# Altium project motherboard_2ch_arduino.PrjPcb
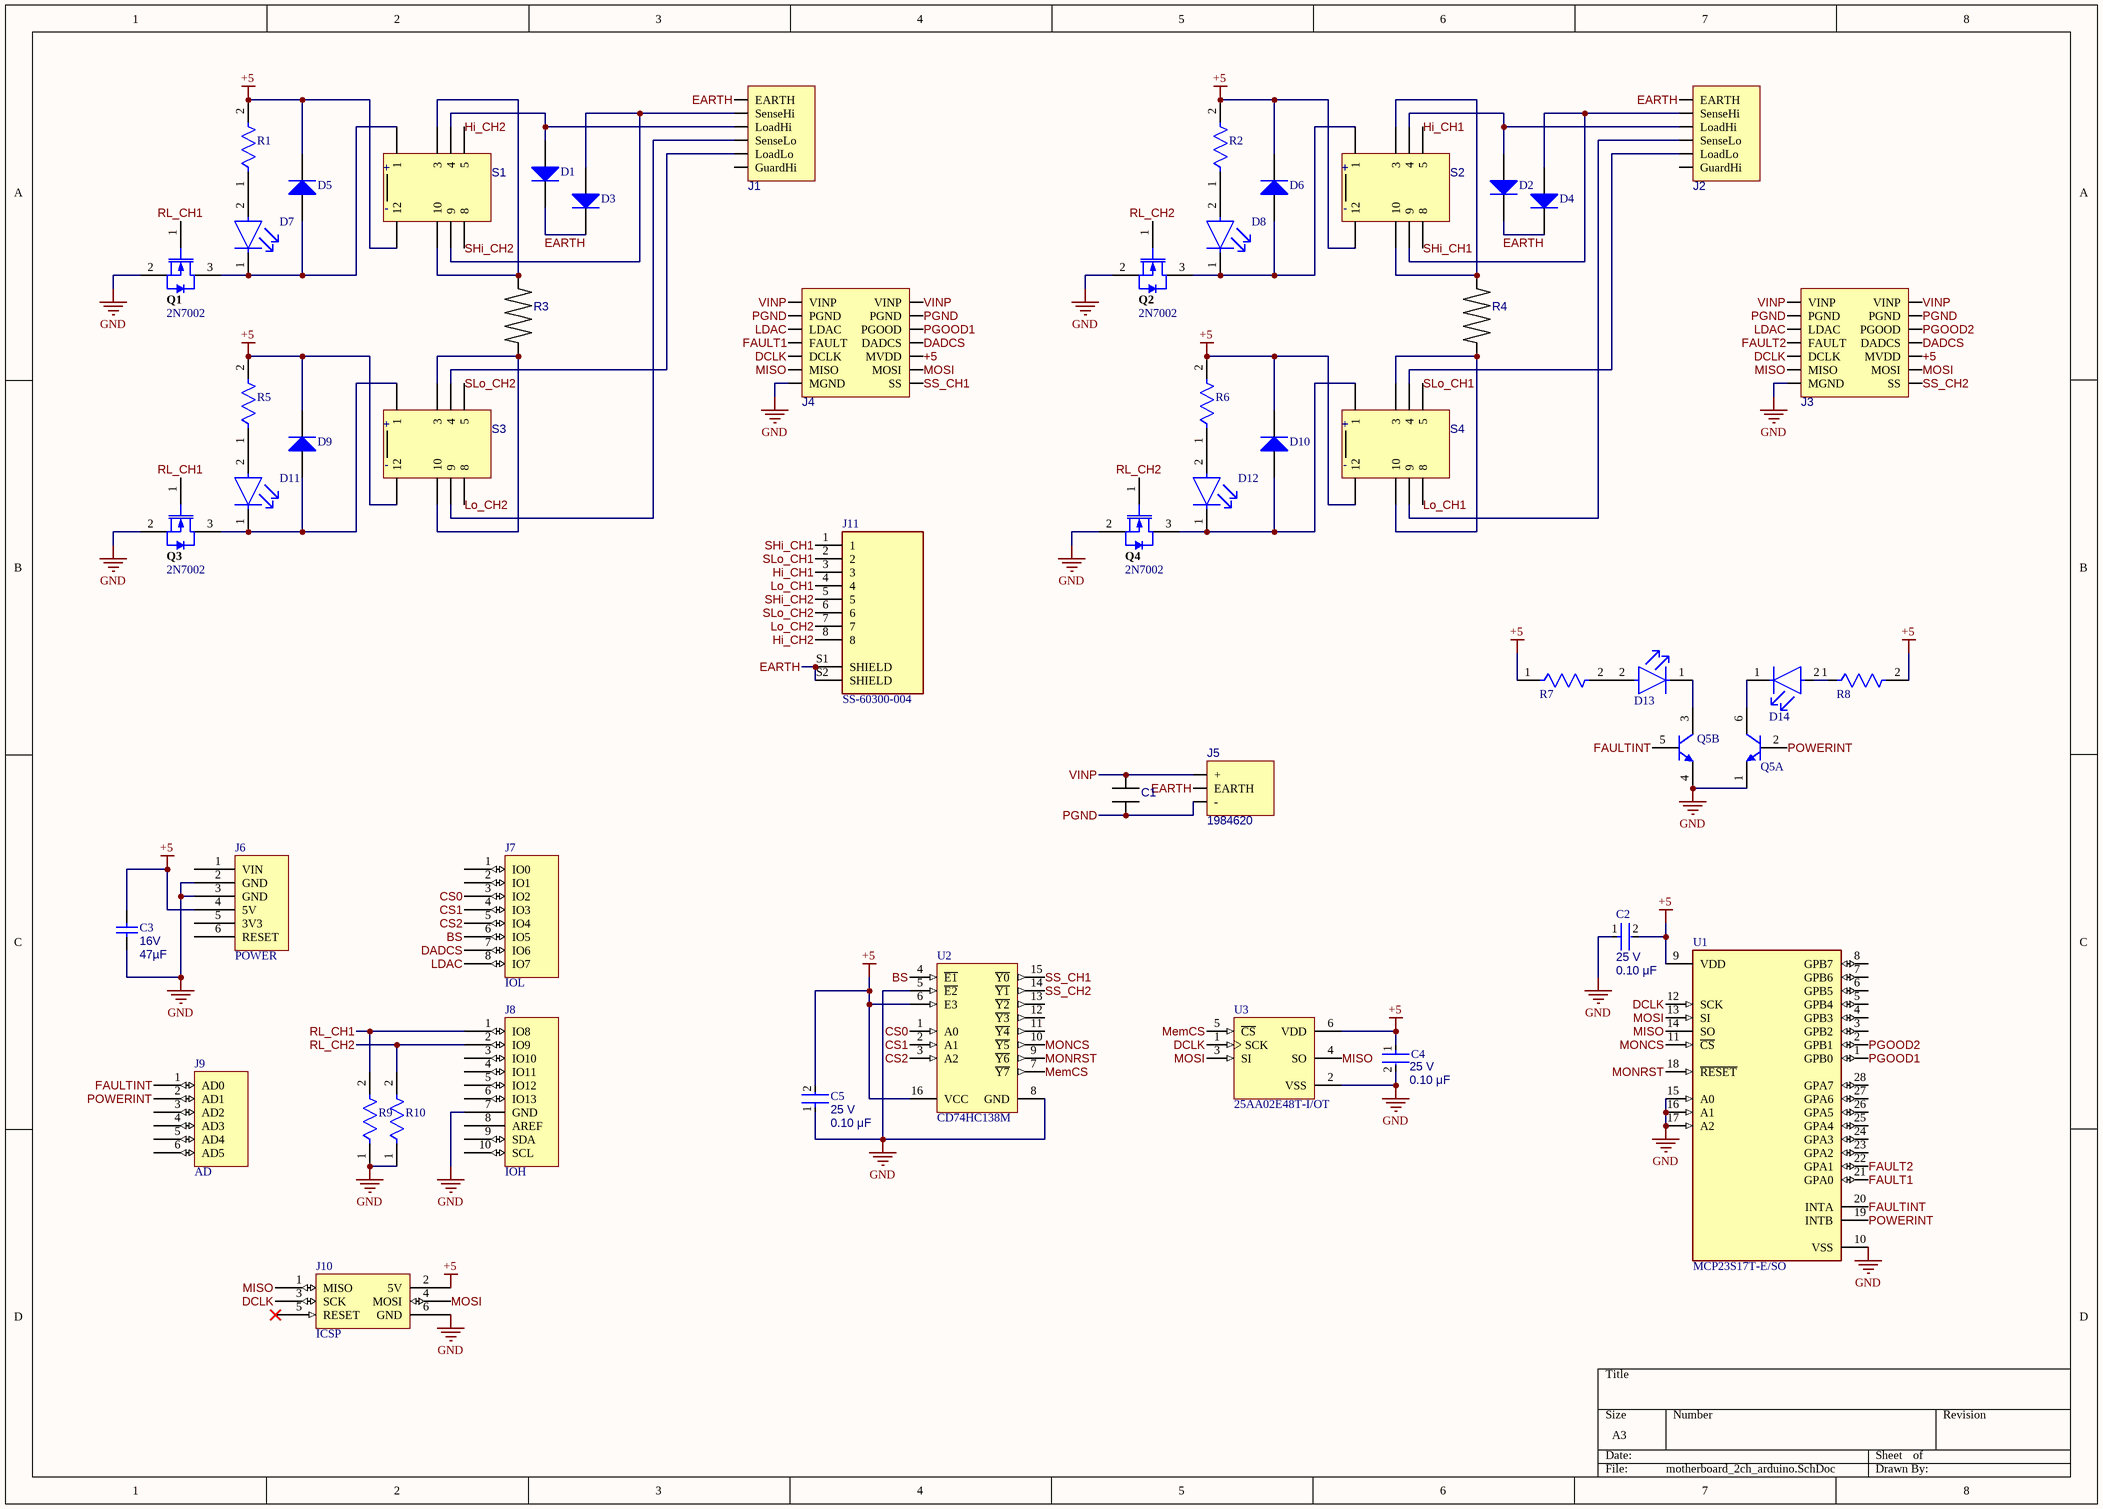
[diagram p0: motherboard_2ch_arduino.SchDoc]
1 sheet, 52 parts. Net scope: global (net labels, ports and power ports of the same name join across sheets).
Board file: motherboard_2ch_arduino.PcbDoc

## Sheet motherboard_2ch_arduino.SchDoc
size A3

### Parts
C1  KRM55TR71H226MH01L  [CAPC6050X50M]  (value not drawn)
C2  value 0.10 μF  Voltage Rating: 25 V  [FP-C1206C-EB-IPC_A]  (hidden comment: C1206C104J3GACAUTO)
C3  Voltage Rating DC: 16V  Capacitance: 47µF  [MURA-1210_H_2.7_M]  (hidden comment: 1210YD107MAT2A)
C4  value 0.10 μF  Voltage Rating: 25 V  [FP-C1206C-EB-IPC_A]  (hidden comment: C1206C104J3GACAUTO)
C5  value 0.10 μF  Voltage Rating: 25 V  [FP-C1206C-EB-IPC_A]  (hidden comment: C1206C104J3GACAUTO)
D1  SMAJ33CA-TR  [STM-SMA-2_V]  (value not drawn)
D2  SMAJ33CA-TR  [STM-SMA-2_V]  (value not drawn)
D3  SMAJ33CA-TR  [STM-SMA-2_V]  (value not drawn)
D4  SMAJ33CA-TR  [STM-SMA-2_V]  (value not drawn)
D5  1N4148W-7-F  [DIOD-SOD123-2_V]  (value not drawn)
D6  1N4148W-7-F  [DIOD-SOD123-2_V]  (value not drawn)
D7  LTST-C150KGKT  [FP-LTST-C150KGKT-MFG]  (value not drawn)
D8  LTST-C150KGKT  [FP-LTST-C150KGKT-MFG]  (value not drawn)
D9  1N4148W-7-F  [DIOD-SOD123-2_V]  (value not drawn)
D10  1N4148W-7-F  [DIOD-SOD123-2_V]  (value not drawn)
D11  LTST-C150KGKT  [FP-LTST-C150KGKT-MFG]  (value not drawn)
D12  LTST-C150KGKT  [FP-LTST-C150KGKT-MFG]  (value not drawn)
D13  LTST-C150KGKT  [FP-LTST-C150KGKT-MFG]  (value not drawn)
D14  LTST-C150KGKT  [FP-LTST-C150KGKT-MFG]  (value not drawn)
J1  5-146276-6  [SMUIO]  (value not drawn)
J2  5-146276-6  [SMUIO]  (value not drawn)
J3  5-146252-7  [DATAIO]  (value not drawn)
J4  5-146252-7  [DATAIO]  (value not drawn)
J5  1984620  [1984620]
J6  POWER  [Header 6x1 8.5mm]
J7  IOL  [Header 8x1 8.5mm]
J8  IOH  [Header 10x1 8.5mm]
J9  AD  [Header 6x1 8.5mm]
J10  ICSP  [ICSP]
J11  SS-60300-004  [BEL_SS-60300-004]
Q1  2N7002  [INF-PG-SOT23_M]
Q2  2N7002  [INF-PG-SOT23_M]
Q3  2N7002  [INF-PG-SOT23_M]
Q4  2N7002  [INF-PG-SOT23_M]
Q5  MBT3904DW1T1G  [ONSC-SOT-363-6-419B-02_W_V]  (value not drawn)  (parts A,B of 2)
R1  RN73R2BTTD1001B25  [FP-RC3216-IPC_A]  (value not drawn)
R2  RC3216J102CS  [FP-RC3216-IPC_A]  (value not drawn)
R3  Y1453500R000V9L  [Y1453500R000V9L]  (value not drawn)
R4  Y1453500R000V9L  [Y1453500R000V9L]  (value not drawn)
R5  RC3216J102CS  [FP-RC3216-IPC_A]  (value not drawn)
R6  RC3216J102CS  [FP-RC3216-IPC_A]  (value not drawn)
R7  RC3216J102CS  [FP-RC3216-IPC_A]  (value not drawn)
R8  RC3216J102CS  [FP-RC3216-IPC_A]  (value not drawn)
R9  RN73H2BTTD1002B10  [FP-RC3216-IPC_A]  (value not drawn)
R10  RN73H2BTTD1002B10  [FP-RC3216-IPC_A]  (value not drawn)
S1  G6S-2 DC5  [EE2-5NU]  (value not drawn)
S2  G6S-2 DC5  [EE2-5NU]  (value not drawn)
S3  G6S-2 DC5  [EE2-5NU]  (value not drawn)
S4  G6S-2 DC5  [EE2-5NU]  (value not drawn)
U1  MCP23S17T-E/SO  [FP-C04-052-MFG]
U2  CD74HC138M  [D0016A_M]
U3  25AA02E48T-I/OT  [SOT-23-OT6_M]

### Nets
+5: C2.2 C3.2 C4.1 C5.2 D5.2(K) D6.2(K) D9.2(K) D10.2(K) J3.10(MVDD) J4.10(MVDD) J6.4(5V) J10.2(5V) R1.2 R2.2 R5.2 R6.2 R7.1 R8.2 S1.12 S2.12 S3.12 S4.12 U1.9(VDD) U2.6(E3) U2.16(VCC) U3.6(VDD)
GND: C2.1 C3.1 C4.2 C5.1 J3.13(MGND) J4.13(MGND) J6.2(GND) J6.3(GND) J8.7(GND) J10.6(GND) Q1.2(SOURCE) Q2.2(SOURCE) Q3.2(SOURCE) Q4.2(SOURCE) Q5.1(E) Q5.4(E) R9.1 R10.1 U1.10(VSS) U1.15(A0) U1.16(A1) U1.17(A2) U2.5(~{E2}) U2.8(GND) U3.2(VSS)
BS: J7.6(IO5) U2.4(~{E1})
CS0: J7.3(IO2) U2.1(A0)
CS1: J7.4(IO3) U2.2(A1)
CS2: J7.5(IO4) U2.3(A2)
DADCS: J3.8(DADCS) J4.8(DADCS) J7.7(IO6)
DCLK: J3.9(DCLK) J4.9(DCLK) J10.3(SCK) U1.12(SCK) U3.1(SCK)
EARTH: D1.2(K) D2.2(K) D3.2(K) D4.2(K) J1.1(EARTH) J2.1(EARTH) J5.2(EARTH) J11.S1(SHIELD) J11.S2(SHIELD)
FAULT1: J4.7(FAULT) U1.21(GPA0)
FAULT2: J3.7(FAULT) U1.22(GPA1)
FAULTINT: J9.1(AD0) Q5.5(B) U1.20(INTA)
Hi_CH1: J11.3 S2.5
Hi_CH2: J11.8 S1.5
LDAC: J3.5(LDAC) J4.5(LDAC) J7.8(IO7)
Lo_CH1: J11.4 S4.8
Lo_CH2: J11.7 S3.8
MemCS: U2.7(~{Y7}) U3.5(~{CS})
MISO: J3.11(MISO) J4.11(MISO) J10.1(MISO) U1.14(SO) U3.4(SO)
MONCS: U1.11(~{CS}) U2.10(~{Y5})
MONRST: U1.18(~{RESET}) U2.9(~{Y6})
MOSI: J3.12(MOSI) J4.12(MOSI) J10.4(MOSI) U1.13(SI) U3.3(SI)
PGND: C1.1 J3.3(PGND) J3.4(PGND) J4.3(PGND) J4.4(PGND) J5.3(-)
PGOOD1: J4.6(PGOOD) U1.1(GPB0)
PGOOD2: J3.6(PGOOD) U1.2(GPB1)
POWERINT: J9.2(AD1) Q5.2(B) U1.19(INTB)
RL_CH1: J8.1(IO8) Q1.1(GATE) Q3.1(GATE) R9.2
RL_CH2: J8.2(IO9) Q2.1(GATE) Q4.1(GATE) R10.2
SHi_CH1: J11.1 S2.8
SHi_CH2: J11.5 S1.8
SLo_CH1: J11.2 S4.5
SLo_CH2: J11.6 S3.5
SS_CH1: J4.14(SS) U2.15(~{Y0})
SS_CH2: J3.14(SS) U2.14(~{Y1})
VINP: C1.2 J3.1(VINP) J3.2(VINP) J4.1(VINP) J4.2(VINP) J5.1(+)
NetD1_1: D1.1(A) J1.3(LoadHi) S1.4
NetD2_1: D2.1(A) J2.3(LoadHi) S2.4
NetD3_1: D3.1(A) J1.2(SenseHi) S1.9
NetD4_1: D4.1(A) J2.2(SenseHi) S2.9
NetD5_1: D5.1(A) D7.1(C) Q1.3(DRAIN) S1.1
NetD6_1: D6.1(A) D8.1(C) Q2.3(DRAIN) S2.1
NetD7_2: D7.2(A) R1.1
NetD8_2: D8.2(A) R2.1
NetD9_1: D9.1(A) D11.1(C) Q3.3(DRAIN) S3.1
NetD10_1: D10.1(A) D12.1(C) Q4.3(DRAIN) S4.1
NetD11_2: D11.2(A) R5.1
NetD12_2: D12.2(A) R6.1
NetD13_1: D13.1(C) Q5.3(C)
NetD13_2: D13.2(A) R7.2
NetD14_1: D14.1(C) Q5.6(C)
NetD14_2: D14.2(A) R8.1
NetJ1_4: J1.4(SenseLo) S3.9
NetJ1_5: J1.5(LoadLo) S3.4
NetJ2_4: J2.4(SenseLo) S4.9
NetJ2_5: J2.5(LoadLo) S4.4
NetR3_1: R3.1 S3.3 S3.10
NetR3_2: R3.2 S1.3 S1.10
NetR4_1: R4.1 S4.3 S4.10
NetR4_2: R4.2 S2.3 S2.10

Not connected (* = marked no-connect by the designer): J1 6(GuardHi); J2 6(GuardHi); J6 1(VIN) 5(3V3) 6(RESET); J7 1(IO0) 2(IO1); J8 3(IO10) 4(IO11) 5(IO12) 6(IO13) 8(AREF) 9(SDA) 10(SCL); J9 3(AD2) 4(AD3) 5(AD4) 6(AD5); J10 5(RESET)*; U1 3(GPB2) 4(GPB3) 5(GPB4) 6(GPB5) 7(GPB6) 8(GPB7) 23(GPA2) 24(GPA3) 25(GPA4) 26(GPA5) 27(GPA6) 28(GPA7); U2 11(~{Y4}) 12(~{Y3}) 13(~{Y2})

### Notes on the sheet
- (in symbol EE2-5NU) +; -

### Library data of the parts
C1 = CAP22uF
C2 C4 C5 = CMP-03020-020888-1: CAP CER 0.1UF 25V C0G/NP0 1206; Manufacturer: KEMET; Temperature Characteristic: C0G; Material: Ceramic; Automotive Grade: Grade 0; Tolerance: 0.05; Temperature Coefficient: 15%; Digikey Description: CAP CER 0.1UF 25V C0G/NP0 1206; Category: Cap; Automotive: Yes; Manufacturer Part Number: C1206C104J3GACAUTO; Device Class L1: Passive Components; Ipc Land Pattern Name: CAPC320160X78; ComponentLink2Description: Datasheet; Temperature Range High: +150°C; Capacitance: 0.10 μF; Mouser Description: Multilayer Ceramic Capacitor, AEC-Q200 MLCC Series, 0.1 - F, - 5%, C0G / NP0, 25 V; Lead Free: Yes; Temperature: -55°C to +150°C; Device Class L2: Capacitors; Octopart: https://octopart.com/c1206c104j3gacauto-kemet-22570084; RoHS: TRUE; Temperature Range Low: -55°C; ComponentLink2URL: https://content.kemet.com/datasheets/KEM_C1007_X8R_ULTRA_150C_SMD.pdf; Device Class L3: Ceramic Capacitors; Height: 0.88mm; Package: C1206C-EB
C3 = CMP-2000-06362-1: Cap Ceramic, 47 uF, +/- 10%, -55 to 85 degC, 2-Pin SMD (1210), RoHS, Tape and Reel; Manufacturer: Murata; Catalog Drawings: GRMSeries_1210_2.5; Product Training Modules: High-CapMultilayerCeramicCapacitors; Temperature Coefficient: X5R; Online Catalog: GRMSeries; Other Names: 490-6539-6; Lead Style: -; Datasheet URL: http://psearch.en.murata.com/capacitor/product/GRM32ER61C476KE15%23.pdf; Package Description: 2-Pin Surface Mount Device, Body 3.2 x 2.5 mm; Applications: GeneralPurpose; Thickness (Max): 0.106"(2.70mm); Operating Temperature: -55°C~85°C; Mounting Technology: SurfaceMount; Category: Capacitors; Package / Case: 1210(3225Metric); Mounting Type: SurfaceMount,MLCC; Ratings: -; Package Reference: 1210; Height - Seated (Max): -; Series: GRM; Lead Spacing: -; Family: CeramicCapacitors; Datasheet Version: 04/2016; Tolerance: ±10%; Size / Dimension: 0.126"Lx0.098"W(3.20mmx2.50mm); Packaging: Digi-Reel®; Voltage - Rated: 16V; Standard Package: 1; Features: -; Manufacturer URL: http://www.murata.com/
D1-D4 = CMP-2000-05373-2: Transil(TM) Diode, 33 A, 36.7 V, -55 to 150 degC, 2-Pin SMA, RoHS, Tape and Reel; Manufacturer: STMicroelectronics; TVS Polarity: Bidirectional; Peak Pulse Power Dissipation: 400W; Power Dissipation Pd: 400 / W; Reverse Stand-Off Voltage Vrwm: 33V; Breakdown Voltage Min: 36.7V; Product Range: SMAJSeries; Peak Pulse Current Ippm: 7.5 / A; Clamping Voltage Vc Max: 69.7V; No. of Pins: 2Pins; Diode Case Style: DO-214AC; SVHC: NoSVHC(17-Dec-2015); Manufacturer URL: http://www.st.com/; Package Description: 2-Pin Surface Mount Device, Body 4.275 x 2.575 mm; Datasheet Version: Rev. 12, 07/2010; Datasheet URL: http://www.st.com/st-web-ui/static/active/en/resource/technical/document/datasheet/CD00001333.pdf; Packaging: CutTape; Package Reference: SMA; Package URL: http://www.st.com/st-web-ui/static/active/en/resource/technical/document/datasheet/CD00283518.pdf
D5 D6 D9 D10 = CMP-2000-04932-2: Fast Switching Diode, 100 V, 0.15 A, -65 to 150 degC, 2-Pin?SOD123, RoHS, Tape and Reel; Recovery Time: 4ns; Brand: DiodesIncorporated; Unit Weight: 0.000353oz; Max Surge Current: 2A; Peak Reverse Voltage: 100V; Ir - Reverse Current: 1uA; Vf - Forward Voltage: 1.25V; Configuration: Single; If - Forward Current: 0.15A; Product Category: Diodes-GeneralPurpose,Power,Switching; Operating Temperature Range: -65Cto+150C; Packaging: Reel; Manufacturer URL: http://www.diodes.com/; Maximum Operating Temperature: +150C; Height: 1.25mm; Minimum Operating Temperature: -65C; Product: SwitchingDiodes; Package URL: http://www.diodes.com/datasheets/ds18004.pdf; Type: SwitchingDiode; Package Reference: SOD123-2; Width: 1.7mm; Datasheet URL: http://www.farnell.com/datasheets/1915529.pdf; Datasheet Version: Rev. 24-2, 10/2013; Series: 1N4148; Factory Pack Quantity: 3000; Length: 2.85mm; RoHS: True; Manufacturer: DiodesIncorporated; Mounting Style: SMD/SMT; Package / Case: SOD-123
D7 D8 D11-D14 = CMP-22017-000010-1: LED GREEN CLEAR 1206 SMD; Power Dissipation: 75mW; Number of LEDs: 1; Reverse Voltage: 5V; Lens Style: Diffused; Test Current: 20mA; Forward Current: 30mA; Luminous Intensity: 71mcd; Dominant Wavelength: 571nm; Lens Color: Colorless; Viewing Angle: 130°; Forward Voltage: 2V; Wavelength: 574nm; Length: 3.2mm; Case Code (Imperial): 1206; Illumination Color: Green; Number of Pins: 2; Case Code (Metric): 3216; Package Quantity: 1; Height: 1.1mm; Power Rating: 75mW; Color: Green; Lead Free: Lead Free; Mount: Surface Mount; Radiation Hardening: No; Max Operating Temperature: 85°C; Depth: 1.6mm; Case/Package: 1206; Number of Elements: 1; Lens Transparency: Clear; Min Operating Temperature: -55°C; Packaging: Tape and Reel; Width: 1.6mm
J1 J2 = SMUIO
J3 J4 = DATAIO
J5 = POWERJACK
J11 = SS-60300-004: Modular Jack | CAT6a | Horizontal (90) | 8P 8C | NF Shielded; MF: Stewart Connector; MP: SS-60300-004; Package: QFN-16 Stewart Connector; Mouser-Purchase-URL: https://snapeda.com/shop?store=Mouser&id=621521; SnapEDA_Link: https://www.snapeda.com/parts/SS-60300-004/Stewart%20Connector/view-part/621521/?ref=snap; Availability: Unavailable; Price: None; Value: *; DigiKey-Purchase-URL: https://snapeda.com/shop?store=DigiKey&id=621521
Q1-Q4 = CMP-1149-00026-1: N-Channel OptiMOS Small-Signal-Transistor, 60 V VDS, 0.3 A ID, -55 to 150 degC, PG-SOT23, Reel, Green; Manufacturer: Infineon; RDS (on) (max) (@4.5V): 4,000 mOhm; VDS (max): 60 V; IDpuls (max): 1.2Â A; QG: 0.4Â nC; RDS (on) (max): 3,000 mOhm; RthJA (max): 250 K/W; ID (max): 0.3Â A; VGS(th) (max): 2.5Â V; VGS(th) (min): 1.5Â V; Green: TRUE; Ptot (max): 0.5Â W; PackageDescription: 3-Pin Small Outline Transistor Package, 2.9 x 1.3 mm Body, 0.95 mm Pitch; Halogen-free: TRUE; ComponentLink2Description: Datasheet; ComponentLink1URL: http://www.infineon.com/; Packing: Reel; DatasheetVersion: Rev. 2.4; PartNumber: 2N7002; PackageReference: PG-SOT23; PackageVersion: Apr-08; ComponentLink3URL: http://www.infineon.com/dgdl/SOT23-Package_Overview.pdf?folderId=db3a30431936bc4b0119532290053c66&fileId=db3a30431936bc4b0119533468123c85; ComponentLink1Description: Manufacturer URL; Mounting Technology: Surface Mount; ComponentLink3Description: Package Specification; ComponentLink2URL: http://www.infineon.com/dgdl/2N7002_Rev2.4.pdf?folderId=db3a3043156fd573011622e10b5c1f67&fileId=db3a304319bc939a0119c2a9461e79e6
Q5 = CMP-1048-00877-1: Dual General Purpose Transistors, 6-Pin SOT-363, Pb-Free, Tape and Reel; Manufacturer: On Semiconductor; Polarity: Dual NPN; fT Min (MHz): 300; IC Continuous (A): 0.2; DatasheetVersion: Rev. 9; ComponentLink2Description: Datasheet; Mounting Technology: Surface Mount; PackageReference: SOT-363-6-419B-02_W; RoHS: TRUE; ComponentLink1Description: Manufacturer URL; ComponentLink2URL: http://www.onsemi.com/pub_link/Collateral/MBT3904DW1T1-D.PDF; PackageVersion: Rev. W, 01/2006; Packing: Tape and Reel; PartNumber: MBT3904DW1T1G; ComponentLink1URL: http://www.onsemi.com/; ComponentLink3URL: http://www.onsemi.com/pub_link/Collateral/NTJD4001N-D.PDF; ComponentLink3Description: Package Specification; PackageDescription: 6-Pin Small Outline Transistor, Body 2 x 1.25 mm, Pitch 0.65 mm
R1 R2 R5-R8 = CMP-13261-001932-1: Res Thick Film 1206 1kΩ 5% 0.25W ±100ppm/°C Molded SMD T/R; Max Power Dissipation: 250mW; Resistance: 1kR; Voltage Rating (DC): 200V; Width: 0.063inch; Length: 0.126inch; Min Operating Temperature: -55°C; Packaging: Tape and Reel; Case Code (Metric): 3216; Contact Plating: Tin; Composition: Thick Film; Military Standard: Not; Depth: 1.6mm; Lead Free: Lead Free; Height: 0.026inch; Case Code (Imperial): 1206; Number of Terminations: 2; Radiation Hardening: No; Case/Package: 1206; Features: Moisture Resistant; Power Rating: 250mW; Max Operating Temperature: 155°C; Tolerance: 5%; Temperature Coefficient: 100ppm/°C
R9 R10 = CMP-13261-000768-1: RES SMD 10K OHM 1% 1/4W 1206; Resistance: 10kR; Temperature Coefficient: 100ppm/°C; Max Power Dissipation: 250mW; Voltage Rating (DC): 200V; Length: 0.126inch; Tolerance: 1%; Case Code (Imperial): 1206; Radiation Hardening: No; Number of Terminations: 2; Width: 0.063inch; Max Operating Temperature: 155°C; Case Code (Metric): 3216; Case/Package: 1206; Lead Free: Lead Free; Min Operating Temperature: -55°C; Features: Moisture Resistant; Depth: 1.6mm; Composition: Thick Film; Packaging: Tape and Reel; Contact Plating: Tin; Military Standard: Not; Height: 0.026inch
S1-S4 = EE2-5NU
U1 = CMP-06293-000003-1: IC I/O EXPANDER SPI 16B 28SOIC; Power Dissipation: 700mW; Nominal Supply Current: 1mA; Frequency: 10MHz; Min Supply Voltage: 4.5V; Number of Bits: 16; Max Supply Voltage: 5.5V; Number of Channels: 1; Package Quantity: 1600; Min Operating Temperature: -40°C; Mount: Surface Mount; Lead Free: Lead Free; REACH SVHC: No SVHC; Packaging: Tape and Reel; Interface: SPI; Max Operating Temperature: 125°C; Case/Package: SOIC; Number of Pins: 28; Number of I/Os: 16; Max Frequency: 10MHz
U2 = CMP-1633-00149-2: High Speed CMOS Logic 3-to-8 Line Decoder Demultiplexer Inverting and Non-Inverting, D0016A, TUBE; Manufacturer: Texas Instruments; ICC @ Nom Voltage(Max)(mA): 0.08; Schmitt Trigger: No; Configuration: 3：8; tpd @ Nom Voltage(Max)(ns): 30; Input Type: LVTTL/CMOS; Function: Decoder/Demultiplexer; Channels(#): 1; Voltage(Nom)(V): 3.3,5; VCC(Min)(V): 2; VCC(Max)(V): 6; Rating: Catalog; F @ Nom Voltage(Max)(Mhz): 28; Output Drive (IOL/IOH)(Max)(mA): 5.2/-5.2; Technology Family: HC; Bits(#): 8; Operating Temperature Range(C): -55 to 125; PackageReference: D0016A; Type: Standard; Code_JEDEC: MS-012 variation AC; DatasheetVersion: SCHS147I; Generic Part Number: CD74HC138; Output Type: CMOS
U3 = CMP-0165-00270-1: 2K SPI Bus Serial EEPROM with EUI-48 Node Identity, 6-Pin SOT-23, Industrial Temperature, Tape and Reel; DatasheetVersion: revA, Dec-2008; PackageReference: SOT-23-OT6; PackageVersion: revBB, Aug-2009; PackageDescription: 6-Lead Plastic Small Outline Transistor (OT) [SOT-23]; Code_IPC: SOT26A-6
J6 = POWER: Supplier 1: Arrow; Supplier 2: Arrow; Supplier 3: Newark; Supplier 4: Digi-Key; Supplier Part Number 1: 2699075; Supplier Part Number 2: 2699089; Supplier Part Number 3: 11P8269; Supplier Part Number 4: SAM1198-06-ND
J7 = IOL: Supplier 1: Arrow; Supplier 2: Arrow; Supplier 3: Digi-Key; Supplier Part Number 1: 2698925; Supplier Part Number 2: 2698940; Supplier Part Number 3: SAM1198-08-ND
J8 = IOH: Supplier 1: Arrow; Supplier 2: Arrow; Supplier 3: Digi-Key; Supplier Part Number 1: 2698789; Supplier Part Number 2: 2698803S4475693N1004; Supplier Part Number 3: SAM1198-10-ND
J9 = AD: Supplier 1: Arrow; Supplier 2: Arrow; Supplier 3: Digi-Key; Supplier 4: Newark; Supplier Part Number 1: 52553843; Supplier Part Number 2: 2699089; Supplier Part Number 3: SAM1198-06-ND; Supplier Part Number 4: 11P8269
J10 = ICSP: Supplier 1: Digi-Key; Supplier 2: Arrow; Supplier 3: Arrow; Supplier Part Number 1: SAM1185-03-ND; Supplier Part Number 2: 2699340; Supplier Part Number 3: 46091550